# Altium schematic sheet Acquisition-System_V1.0.SchDoc: Acquisition-System
size A4; PageSetup: Record=PageOptions|CenterHorizontal=True|CenterVertical=True|PrintScale=0.97|XCorrection=1.00|YCorrection=1.00|PrintKind=0|BorderSize=5000000|LeftOffset=0|BottomOffset=0|Orientation=2|PaperLength=1000|PaperWidth=1000|Scale=100|PaperSource=7|PrintQuality=-3|MediaType=1|DitherType=10|PrintScaleMode=1|PaperKind=A4|PaperIndex=9; Organization: Ostschweizer Fachhochschule; Address2: Florian Baumgartner & Alain Keller; Address3: florian.baumgartner@ost.ch; DocumentNumber: 1; Revision: V1.0; SheetNumber: 1; SheetTotal: 5; Author: Florian Baumgartner & Alain Keller; Subtitle: Overview
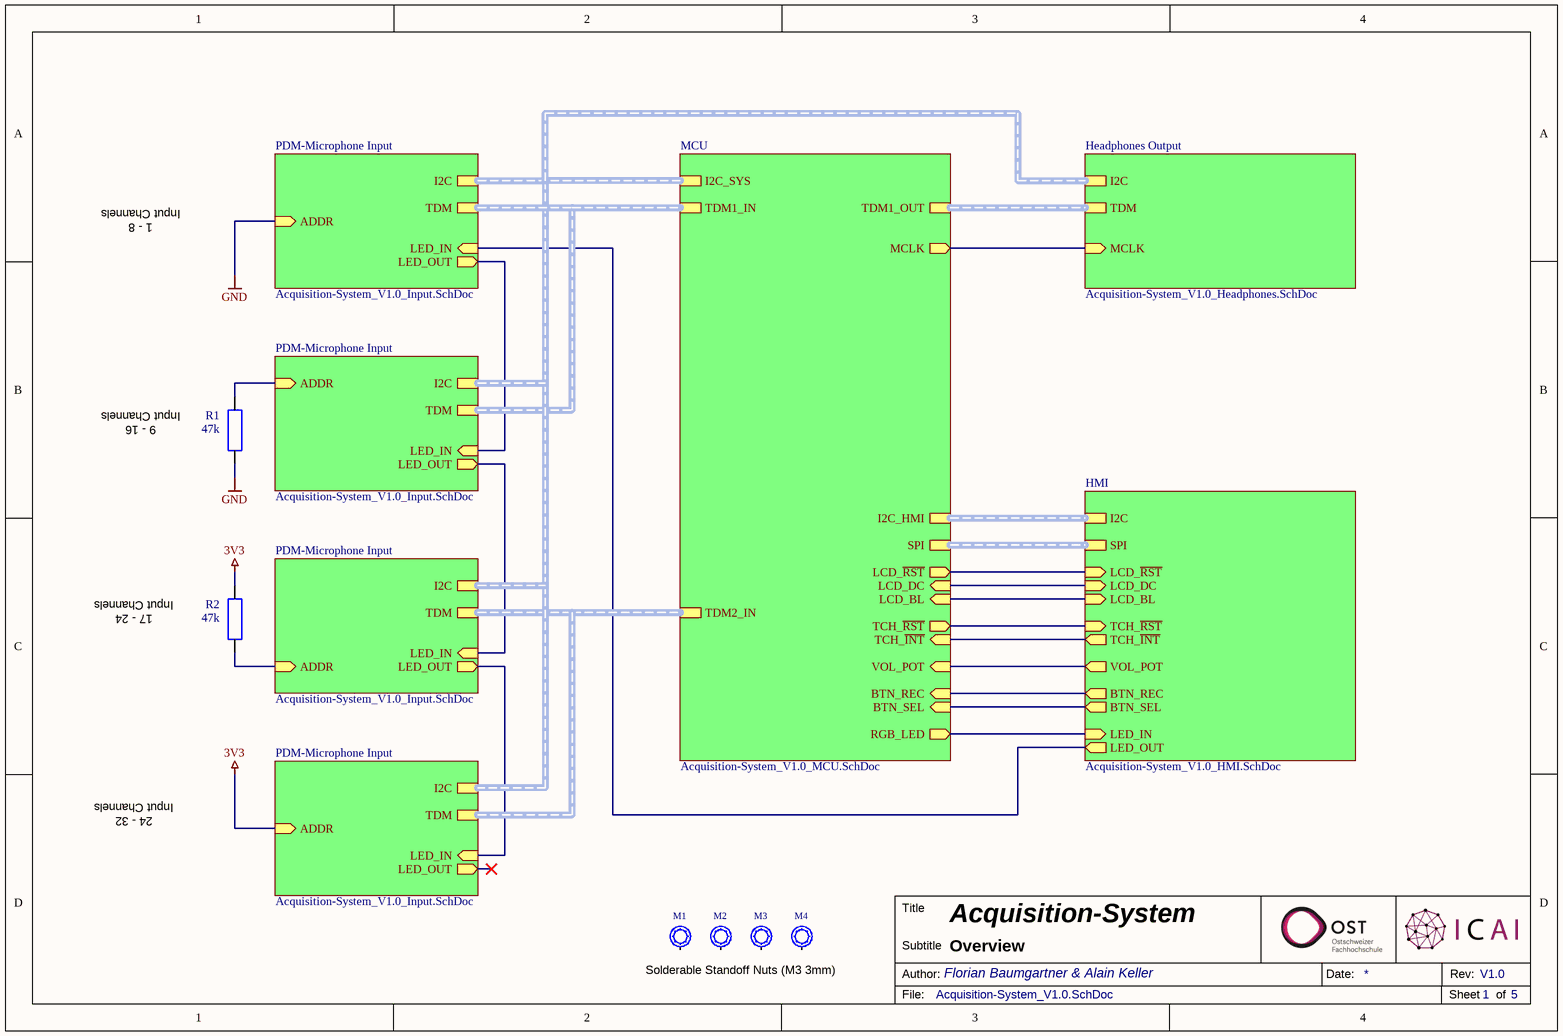
[diagram p0: Acquisition-System_V1.0.SchDoc]

## Parts
M1  SMTSO-M3-3ET  [SMD Solder-Nut (M3 3mm)]  (value not drawn)
M2  SMTSO-M3-3ET  [SMD Solder-Nut (M3 3mm)]  (value not drawn)
M3  SMTSO-M3-3ET  [SMD Solder-Nut (M3 3mm)]  (value not drawn)
M4  SMTSO-M3-3ET  [SMD Solder-Nut (M3 3mm)]  (value not drawn)
R1  47k  [SMD Keramikkondensator 0603]
R2  47k  [SMD Keramikkondensator 0603]

## Sub-sheets
Headphones Output = Acquisition-System_V1.0_Headphones.SchDoc: I2C (harness I2C), TDM (harness TDM), MCLK (in)
HMI = Acquisition-System_V1.0_HMI.SchDoc: TCH_~{INT} (out), BTN_REC (out), TCH_~{RST} (in), LCD_BL (in), LCD_~{RST} (in), LED_IN (in), BTN_SEL (out), I2C (harness I2C), LCD_DC (in), SPI (harness SPI), VOL_POT (out), LED_OUT (out)
MCU = Acquisition-System_V1.0_MCU.SchDoc: I2C_SYS (harness I2C_SYS), LCD_BL (in), VOL_POT (in), MCLK (out), LCD_DC (in), TCH_~{RST} (out), RGB_LED (out), I2C_HMI (harness I2C_HMI), LCD_~{RST} (out), TDM1_OUT (harness TDM1_OUT), SPI (harness SPI), BTN_REC (in), BTN_SEL (in), TCH_~{INT} (in), TDM1_IN (harness TDM1_IN), TDM2_IN (harness TDM2_IN)
PDM-Microphone Input = Acquisition-System_V1.0_Input.SchDoc: I2C (harness I2C), LED_IN (in), TDM (harness TDM), LED_OUT (out), ADDR (in)
PDM-Microphone Input = Acquisition-System_V1.0_Input.SchDoc: I2C (harness I2C), LED_IN (in), TDM (harness TDM), LED_OUT (out), ADDR (in)
PDM-Microphone Input = Acquisition-System_V1.0_Input.SchDoc: I2C (harness I2C), LED_IN (in), TDM (harness TDM), LED_OUT (out), ADDR (in)
PDM-Microphone Input = Acquisition-System_V1.0_Input.SchDoc: I2C (harness I2C), LED_IN (in), TDM (harness TDM), LED_OUT (out), ADDR (in)

## Nets
3V3: R2.2 ; sheet PDM-Microphone Input/ADDR
GND: R1.1 ; sheet PDM-Microphone Input/ADDR
NetR1_2: R1.2 ; sheet PDM-Microphone Input/ADDR
NetR2_1: R2.1 ; sheet PDM-Microphone Input/ADDR
(unnamed): sheet PDM-Microphone Input/LED_IN, sheet PDM-Microphone Input/LED_OUT
(unnamed): sheet PDM-Microphone Input/LED_IN, sheet PDM-Microphone Input/LED_OUT
(unnamed): sheet PDM-Microphone Input/LED_IN, sheet PDM-Microphone Input/LED_OUT
(unnamed): sheet PDM-Microphone Input/LED_IN, sheet HMI/LED_OUT
(unnamed): sheet Headphones Output/MCLK, sheet MCU/MCLK
(unnamed): sheet HMI/TCH_~{INT}, sheet MCU/TCH_~{INT}
(unnamed): sheet HMI/BTN_REC, sheet MCU/BTN_REC
(unnamed): sheet HMI/TCH_~{RST}, sheet MCU/TCH_~{RST}
(unnamed): sheet HMI/LCD_BL, sheet MCU/LCD_BL
(unnamed): sheet HMI/LCD_~{RST}, sheet MCU/LCD_~{RST}
(unnamed): sheet HMI/LED_IN, sheet MCU/RGB_LED
(unnamed): sheet HMI/BTN_SEL, sheet MCU/BTN_SEL
(unnamed): sheet HMI/LCD_DC, sheet MCU/LCD_DC
(unnamed): sheet HMI/VOL_POT, sheet MCU/VOL_POT

Not connected (* = marked no-connect by the designer): M1 1; M2 1; M3 1; M4 1

## Buses and harness runs
harness sheet Headphones Output/I2C = sheet MCU/I2C_SYS = sheet PDM-Microphone Input/I2C
harness sheet Headphones Output/TDM = sheet MCU/TDM1_OUT
harness sheet HMI/I2C = sheet MCU/I2C_HMI
harness sheet HMI/SPI = sheet MCU/SPI
harness sheet MCU/TDM1_IN = sheet PDM-Microphone Input/TDM
harness sheet MCU/TDM2_IN = sheet PDM-Microphone Input/TDM

## Notes on the sheet
- Input Channels
- 1 - 8
- (near R1) Input Channels
- 9 - 16
- 17 - 24
- 24 - 32
- Solderable Standoff Nuts (M3 3mm)
- Title
- Author:
- Subtitle
- Date:
- Rev:
- File:
- Sheet
- of

## Library data of the parts
M1-M4 = M-Spacer_M3_3mm: Solderable Standoff Nut; Component Value: M3 3mm; Mouser: 153-SMTSO-M3-3ET; Component Description: Solderable Standoff Nut; Unit Price: 0.05; JLC-Parts: C2915308; ComponentLink1Description: Datasheet; ComponentLink1URL: https://datasheet.lcsc.com/lcsc/2112061830_Sinhoo-SMTSO3030CTJ_C2915308.pdf
R1 R2 = R-RESISTOR: RES (E=Heizwiderstand B=Messwandler); Component Description: Thick Film Chip Resistor; Component Value: 47k (75V, 100mW, 1%); Digikey: P47.0KHCT-ND; Farnell: 2303213; Mouser: 667-ERJ-3EKF4702V; JLC-Parts: C25819; Unit Price: 0.01